# EasyEDA Pro project ProProject_ssd1306_2024-04-10.epro

# Schematic Schematic1
Create Date: 2023-05-25; Page Name: P1; Project Name: ssd1306; Schematic Name: Schematic1; Update Date: 2023-05-25; Company: 嘉立创EDA; Page Size: A4; Version: V1.0
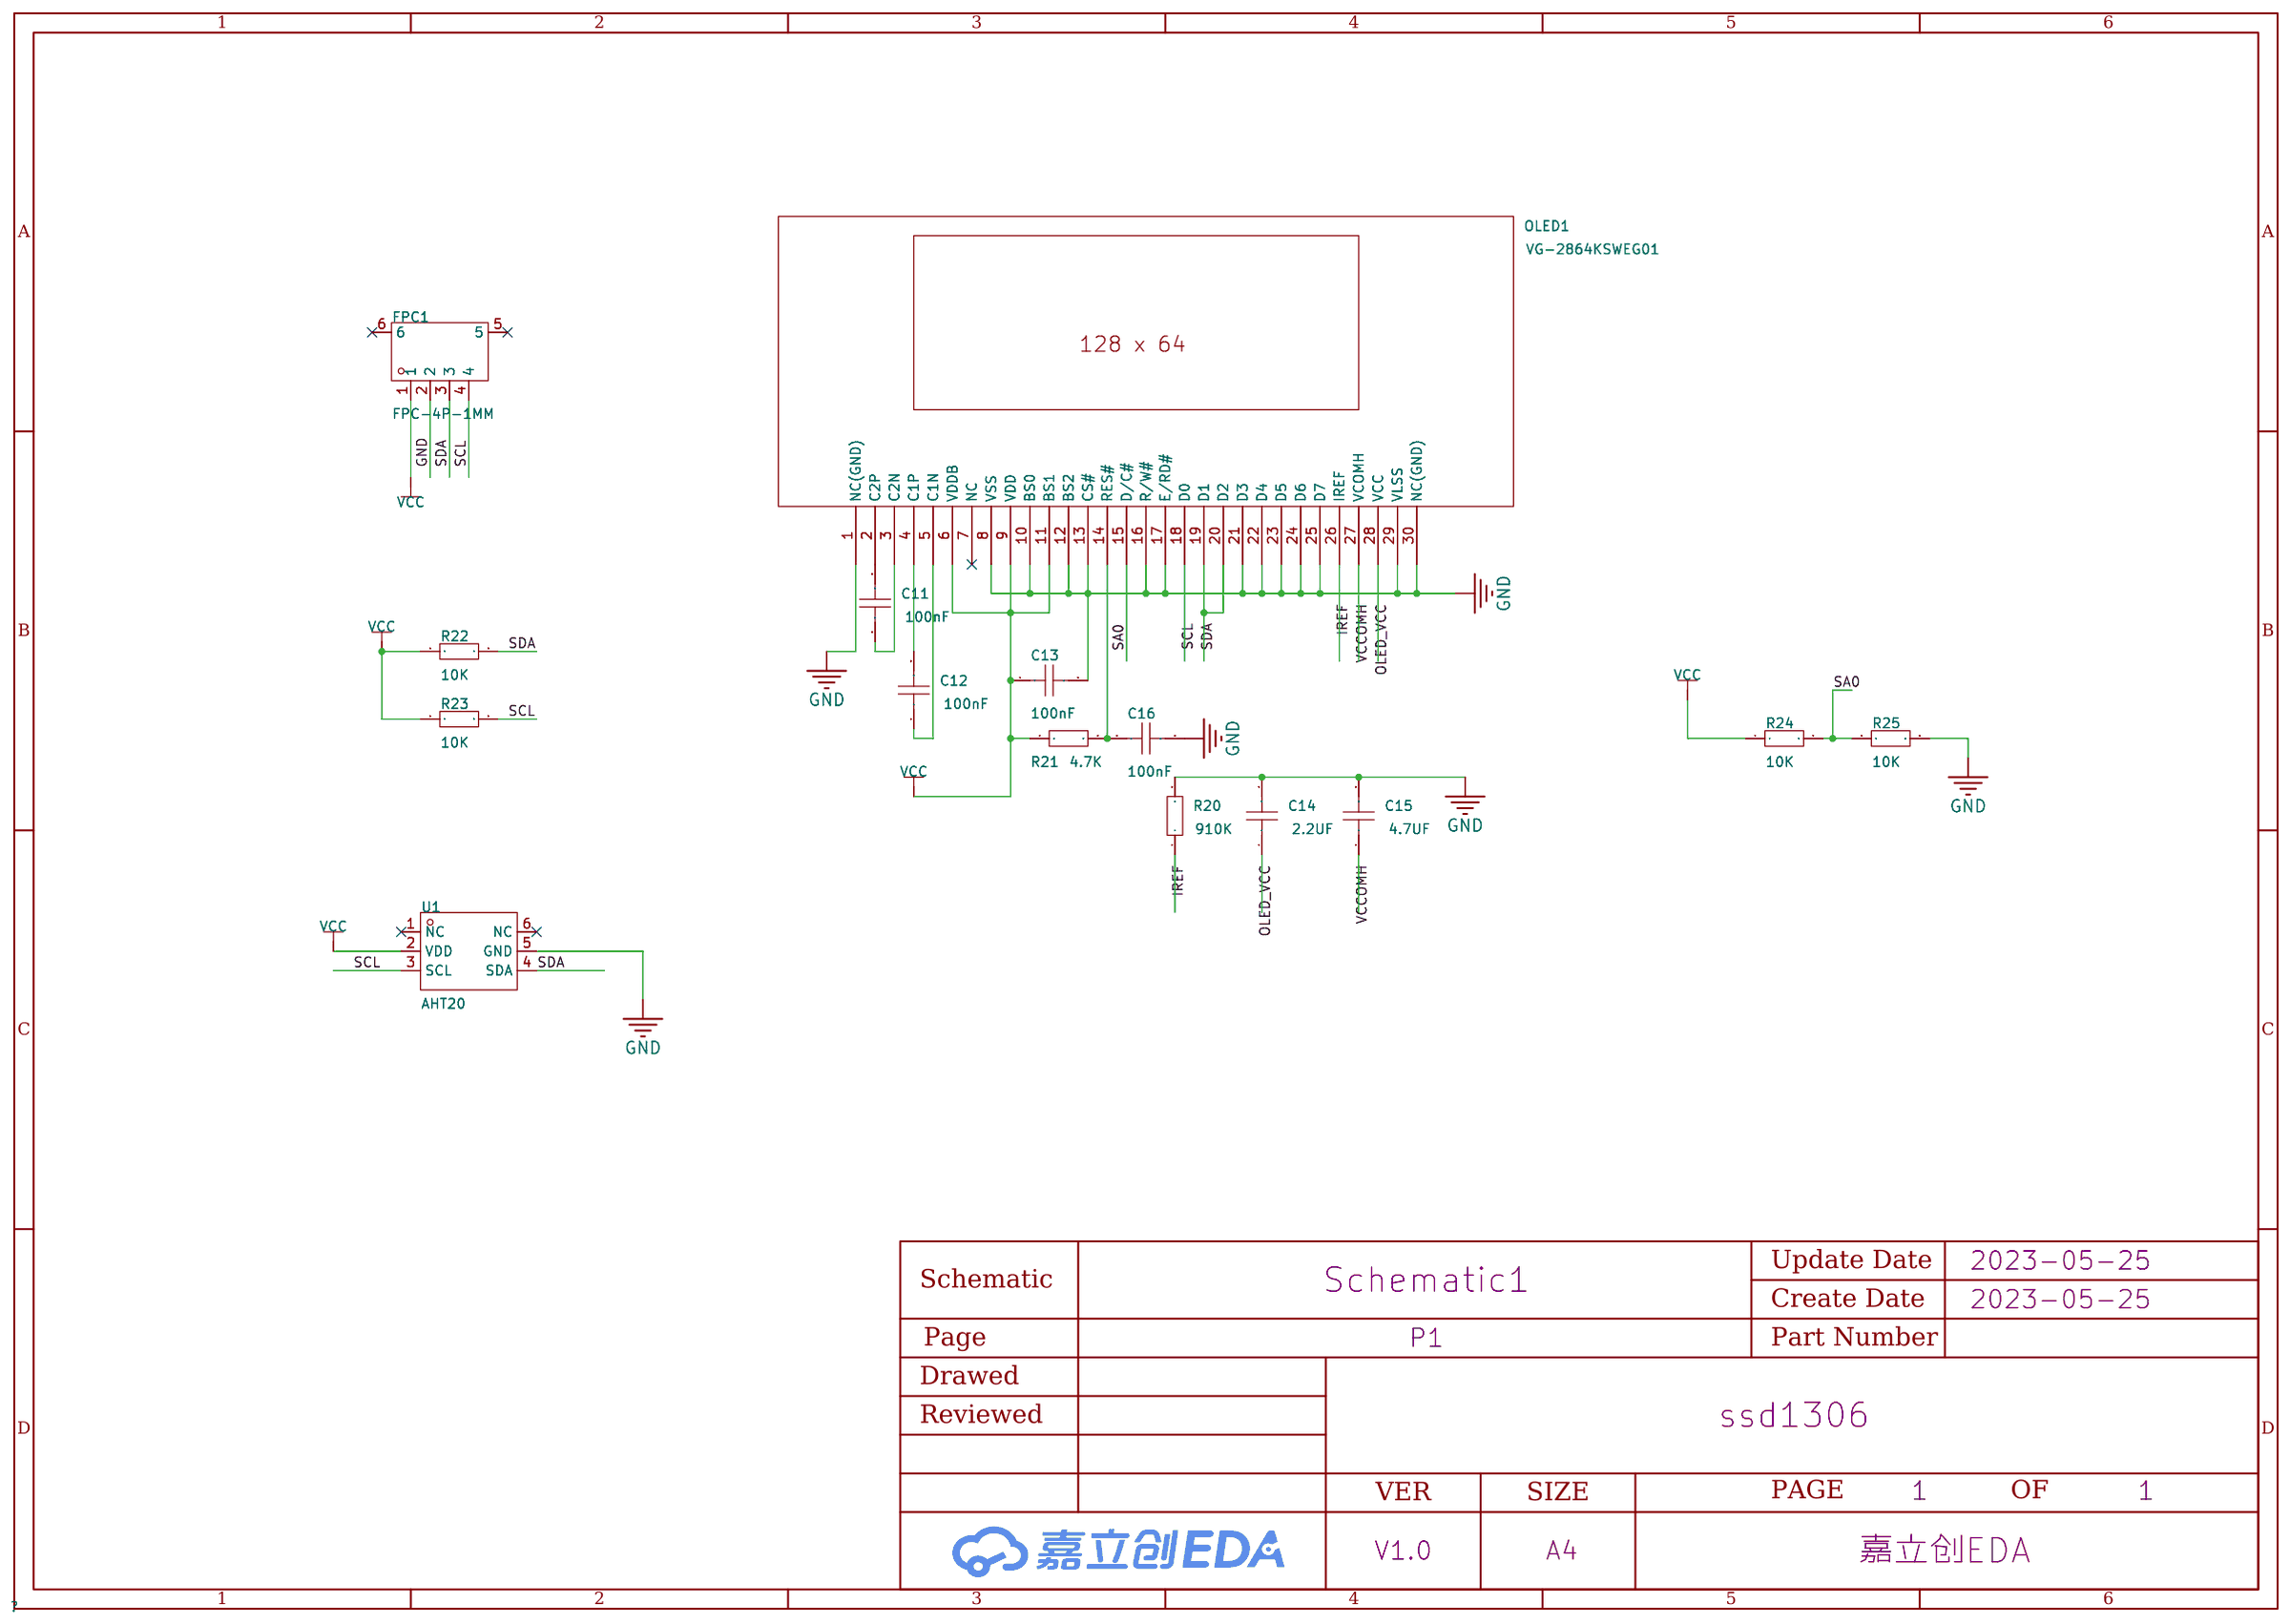
[diagram p0: schematic sheet]

## Parts
C11  100nF  [C0603]
C12  100nF  [C0603]
C13  100nF  [C0603]
C14  2.2UF  [C0603]
C15  4.7UF  [C0603]
C16  100nF  [C0603]
FPC1  FPC-4P-1MM  [FFC-SMD_FFC10032-04SBB123W5M]
OLED1  VG-2864KSWEG01  [OLED_0.96-30P-P0.70-12864]
R20  910K  [R0603]
R21  4.7K  [R0603]
R22  10K  [R0603]
R23  10K  [R0603]
R24  10K  [R0603]
R25  10K  [R0603]
U1  AHT20  [SENSOR-SMD_L3.0-W3.0-P1.00-BR]

## Library data of the parts
C11-C16 = CAP_0603: Supplier Footprint: 0603
FPC1 = FFC10032-04SBB123W5M: 间距:1mm;触点数量:4;锁定特性:翻盖式;安装类型:卧贴;触点类型:下接;工作温度范围:-25℃~+85℃;; LCSC Part Name: 4P 1.0mm; Supplier Part: C2833960; Manufacturer: TXGA(特思嘉); Supplier Footprint: SMD,P=1mm; JLCPCB Part Class: 扩展库; Datasheet: https://atta.szlcsc.com/upload/public/pdf/source/20210517/C2833960_E03CB5ECB54CF7740FC28A24F37CFDA7.pdf; Supplier: LCSC; Pitch: 1mm; Number of Contacts: 4; Locking Feature: 翻盖式; Mounting Type: 卧贴; Contact Type: 下接; Height Above Board: 2.13mm; FFC, FCB Thickness: 0.3mm~0.3mm; Operating Temperature Range: -25℃~+85℃
OLED1 = VG-2864KSWEG01: 尺寸(inch):0.96;主控芯片:SSD1306;; LCSC Part Name: 0.96”128x64白色 VG-2864KSWEG01; Supplier Part: C194313; Manufacturer: WiseChip(智晶光电); JLCPCB Part Class: 扩展库; Datasheet: https://atta.szlcsc.com/upload/public/pdf/source/20190118/C194313_EB7CEF44C1C1CB8B071218A368D72B17.pdf; Supplier: LCSC; Size: 0.96; Main Control Chip: SSD1306
R20-R25 = Res_0603: Supplier Footprint: 0603
U1 = AHT20: Supplier Part: C2757850; Manufacturer: 广州奥松; Supplier Footprint: SMD; JLCPCB Part Class: 扩展库; Datasheet: https://atta.szlcsc.com/upload/public/pdf/source/20231023/00557B34ED120268320A4810FF8DED4D.pdf; Supplier: LCSC

## Nets
GND: C13.2 C14.2 C15.2 C16.2 FPC1.2 OLED1.1(NC(GND)) OLED1.8(VSS) OLED1.10(BS0) OLED1.12(BS2) OLED1.13(CS#) OLED1.16(R/W#) OLED1.17(E/RD#) OLED1.21(D3) OLED1.22(D4) OLED1.23(D5) OLED1.24(D6) OLED1.25(D7) OLED1.29(VLSS) OLED1.30(NC(GND)) R20.2 R25.2 U1.5(GND)
VCC: C13.1 FPC1.1 OLED1.6(VDDB) OLED1.9(VDD) OLED1.11(BS1) R21.1 R22.1 R23.1 R24.1 U1.2(VDD)
VCCOMH: C15.1 OLED1.27(VCOMH)
IREF: OLED1.26(IREF) R20.1
OLED_VCC: C14.1 OLED1.28(VCC)
SA0: OLED1.15(D/C#) R24.2 R25.1
SCL: FPC1.4 OLED1.18(D0) R23.2 U1.3(SCL)
SDA: FPC1.3 OLED1.19(D1) OLED1.20(D2) R22.2 U1.4(SDA)
$1N424: C11.2 OLED1.2(C2P)
$1N425: C12.2 OLED1.4(C1P)
$1N426: C11.1 OLED1.3(C2N)
$1N427: C12.1 OLED1.5(C1N)
$1N447: C16.1 OLED1.14(RES#) R21.2

Not connected (* = marked no-connect by the designer): FPC1 5* 6*; OLED1 7(NC)*; U1 1(NC)* 6(NC)*

# Board PCB1
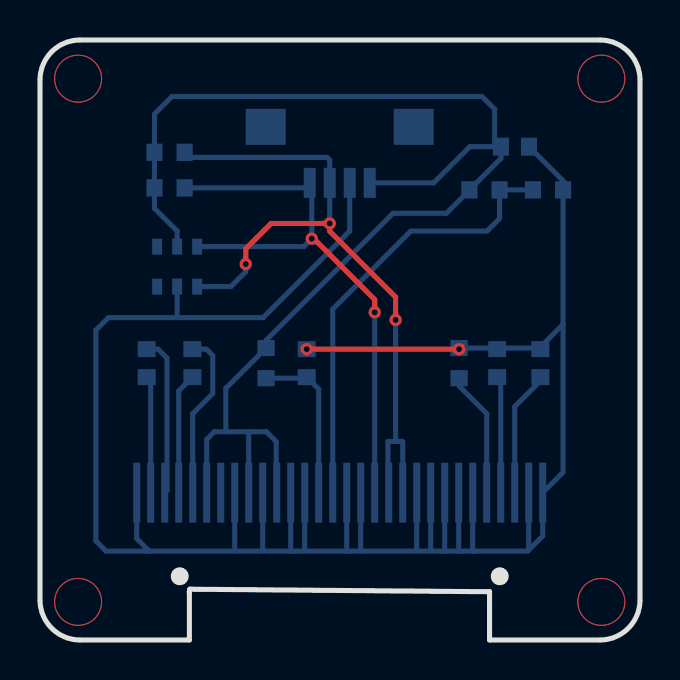
[diagram p1: board, top side]
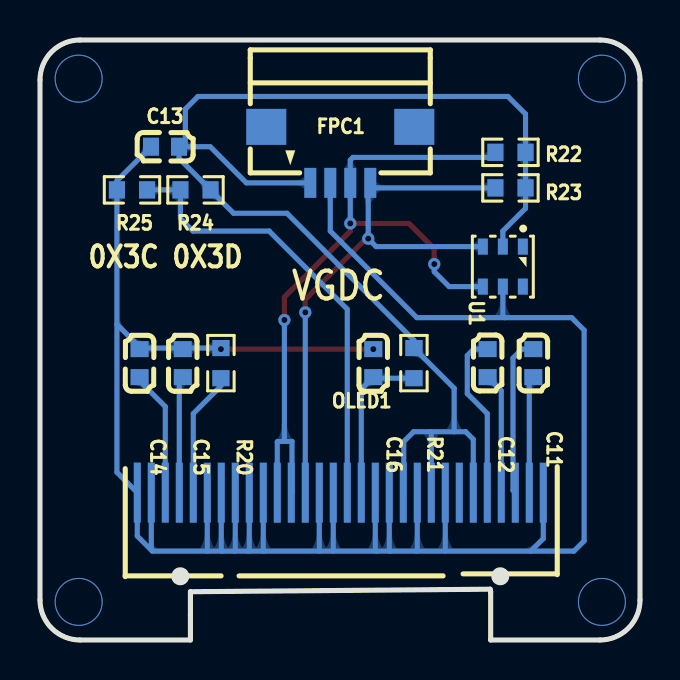
[diagram p2: board, bottom side, seen from below]

Outline 30 x 30 mm; copper layers: Top Layer, Bottom Layer. Coordinates in mm from the lower left corner of the outline.
Outline path: 0,28 0,2 arc(0.59,0.59) 2,0 7.47,0 7.47,2.41 7.49,2.54 22.48,2.41 22.48,0 28,0 arc(29.41,0.59) 30,2 30,28 arc(29.41,29.41) 28,30 2,30 arc(0.59,29.41) 0,28
Stack: Top Layer 0.035mm / Dielectric1 1.51mm FR4 er 4.5 / Bottom Layer 0.035mm

## Design rules (mm)
template: JLCPCB Capability(Two Layers Board)
spacing copperThickness1oz (default): track to track 0.102, other pairs 0.152 to 0.3
spacing copperThickness2oz: track to track 0.203, other pairs 0.152 to 0.3
track width copperThickness1oz (default): min 0.127, default 0.254, max 2.54
track width copperThickness2oz: min 0.203, default 0.254, max 2.54
differential pair differentialPair (default): width min 0.127, default 0.254, max 2.54; gap min 0.152, default 0.152
via viaSize (default): diameter min 0.5, default 0.61, max 10; hole min 0.3, default 0.305, max 6.3

## Placement (name value [footprint] x y rotation side)
C11  100nF  [C0603]  5.33 13.84 270 bottom
C12  100nF  [C0603]  7.62 13.84 270 bottom
C13  100nF  [C0603]  23.75 24.67 0 bottom
C14  2.2UF  [C0603]  25.02 13.84 90 bottom
C15  4.7UF  [C0603]  22.86 13.84 90 bottom
C16  100nF  [C0603]  13.33 13.84 90 bottom
FPC1  FPC-4P-1MM  [ffc-smd_ffc10032-04sbb123w5m]  14.99 24.26 0 bottom
OLED1  VG-2864KSWEG01  [OLED_0.96-30P-P0.70-12864]  14.99 7.37 0 bottom
R20  910K  [R0603]  20.95 13.84 90 bottom
R21  4.7K  [R0603]  11.3 13.84 270 bottom
R22  10K  [R0603]  6.48 24.38 0 bottom
R23  10K  [R0603]  6.48 22.61 0 bottom
R24  10K  [R0603]  22.22 22.51 0 bottom
R25  10K  [R0603]  25.4 22.51 0 bottom
U1  AHT20  [SENSOR-SMD_L3.0-W3.0-P1.00-BR]  6.86 18.67 90 bottom

## Footprints (pads in the part's own frame, mm; a bottom-side part is the same pattern mirrored in y, then rotated)
C0603
  rect 0.8x0.9 smd: 1(-0.7,0) 2(0.7,0)
ffc-smd_ffc10032-04sbb123w5m
  rect 0.6x1.5 smd: 1(1.5,1.4) 2(0.5,1.4) 3(-0.5,1.4) 4(-1.5,1.4)
  rect 2x1.8 smd: 5(-3.7,-1.4) 6(3.7,-1.4)
OLED_0.96-30P-P0.70-12864
  rect 0.35x3 smd: 1(-10.15,0.003) 2(-9.45,0.001) 3(-8.75,0.001) 4(-8.05,0.001) 5(-7.35,0.001) 6(-6.65,0.001) 7(-5.95,0.001) 8(-5.25,0.001) 9(-4.55,0.001) 10(-3.85,0.001) 11(-3.15,0.001) 12(-2.45,0.001) 13(-1.75,0.001) 14(-1.05,0.001) 15(-0.35,0.001) 16(0.35,0.001) 17(1.05,0.001) 18(1.75,0.001) 19(2.45,0.001) 20(3.15,0.001) 21(3.85,0.001) 22(4.55,0.001) 23(5.25,0.001) 24(5.95,0.001) 25(6.65,0.001) 26(7.35,0.001) 27(8.05,0.001) 28(8.75,-0.002) 29(9.45,-0.003) 30(10.15,-0.003)
R0603
  rect 0.806x0.864 smd: 1(-0.753,0) 2(0.753,0)
SENSOR-SMD_L3.0-W3.0-P1.00-BR
  rect 0.8x0.5 smd: 1(1,-1) 2(1,0) 3(1,1) 4(-1,1) 5(-1,0) 6(-1,-1)

## Nets
As in the schematic.

Pads without a net: FPC1 5 6; OLED1 7; U1 1 6

## Via types
v1: diameter 2.4, hole 2.3, Top Layer to Bottom Layer, 4 vias
v2: diameter 0.61, hole 0.305, Top Layer to Bottom Layer, 7 vias

## Routing (per net, layer and track width the routed paths; a pad name or vN(x,y) marks a point on that pad's centre or on a via; arc(x,y) is an arc through that point)
GND: length 124.5
  Top Layer w0.254: v2(13.33,14.54) v2(20.95,14.54)
  Bottom Layer w0.254: 21.63,4.45 21.64,4.45 OLED1.25 ; 21.63,4.45 24.38,4.45 24.44,4.5 ; 21.63,4.45 20.89,4.45 ; 19.59,4.45 19.54,4.5 OLED1.22 ; 19.59,4.45 20.28,4.45 ; 19.59,4.45 18.8,4.45 ; 11.18,4.45 11.14,4.49 OLED1.10 ; 11.18,4.45 12.52,4.45 ; 11.18,4.45 5.46,4.45 ; 5.46,4.45 3.3,4.45 2.79,4.95 2.79,15.49 3.42,16.12 6.77,16.12 ; 5.46,4.45 4.84,5.07 OLED1.1 ; 20.28,4.45 20.24,4.49 OLED1.23 ; 20.28,4.45 20.89,4.45 ; 15.36,4.45 15.34,4.47 OLED1.16 ; 15.36,4.45 13.17,4.45 ; 15.36,4.45 16.02,4.45 ; OLED1.8 9.74,4.45 ; 24.44,4.5 OLED1.29 ; 24.44,4.5 25.14,5.2 OLED1.30 26.15,8.39 26.15,15.78 ; 12.52,4.45 13.17,4.45 ; 12.52,4.45 12.54,4.47 OLED1.12 ; 13.17,4.45 13.24,4.52 OLED1.13 ; 26.15,15.78 R25.2 26.15,22.96 C13.2 ; 26.15,15.78 24.97,14.6 ; 16.02,4.45 16.04,4.46 OLED1.17 ; 16.02,4.45 18.8,4.45 ; 6.77,16.12 11.16,16.12 15.49,20.45 FPC1.2 ; 6.77,16.12 6.86,16.21 U1.5 ; OLED1.24 20.94,4.49 20.89,4.45 ; 24.97,14.6 C14.2 ; 24.97,14.6 R20.2 v2(20.95,14.54) ; 18.8,4.45 18.84,4.48 OLED1.21
VCC: length 67.6
  Bottom Layer w0.254: 10.47,10.41 10.44,10.38 OLED1.9 ; 10.47,10.41 9.29,10.41 ; 10.47,10.41 11.32,10.41 11.81,9.92 11.81,7.39 OLED1.11 ; 9.29,10.41 9.29,12.58 R21.1 11.3,14.99 17.65,21.34 20.32,21.34 21.47,22.49 R24.1 23.05,24.08 C13.1 22.82,24.67 ; 9.29,10.41 8.72,10.41 8.34,10.03 OLED1.6 ; 22.82,24.67 21.49,24.67 19.68,22.86 FPC1.1 ; 22.82,24.67 22.73,24.75 22.73,26.54 22.1,27.18 6.6,27.18 5.72,26.3 R22.1 R23.1 5.72,21.58 6.86,20.45 U1.2
VCCOMH: length 5.9
  Bottom Layer w0.254: C15.1 23.04,12.97 OLED1.27
(no net):
  vias: v1(1.91,28.07) v1(1.91,1.91) v1(28.07,28.07) v1(28.07,1.91)
IREF: length 6.3
  Bottom Layer w0.254: R20.1 20.95,12.7 22.34,11.32 OLED1.26
OLED_VCC: length 6.3
  Bottom Layer w0.254: OLED1.28 23.74,11.67 25.02,12.95 C14.1
SA0: length 22.5
  Bottom Layer w0.254: R25.1 R24.2 22.98,21.07 22.35,20.45 18.54,20.45 14.64,16.54 OLED1.15
SCL: length 29.2
  Top Layer w0.254: v2(16.74,16.38) 16.74,17.02 13.69,20.07 v2(13.59,20.07)
  Bottom Layer w0.254: OLED1.18 v2(16.74,16.38) ; R23.2 13.23,22.61 FPC1.4 13.59,22.75 v2(13.59,20.07) 13.19,19.67 U1.3
SDA: length 37.3
  Top Layer w0.254: v2(10.29,18.8) 10.29,19.56 11.56,20.83 v2(14.49,20.83) 14.49,20.44 17.78,17.15 v2(17.78,16)
  Bottom Layer w0.254: R22.2 7.48,24.13 14.35,24.13 14.49,24 FPC1.3 v2(14.49,20.83) ; U1.4 9.54,17.67 10.29,18.42 v2(10.29,18.8) ; OLED1.20 18.14,9.91 18.11,9.93 17.4,9.93 17.4,7.4 OLED1.19 ; v2(17.78,16) 17.78,9.93
$1N424: length 5.9
  Bottom Layer w0.254: C11.2 5.54,12.94 OLED1.2
$1N425: length 6.1
  Bottom Layer w0.254: OLED1.4 6.94,12.46 C12.2
$1N426: length 8
  Bottom Layer w0.254: C11.1 5.9,14.54 6.35,14.1 6.35,7.48 OLED1.3
$1N427: length 8.4
  Bottom Layer w0.254: C12.1 8.32,14.54 8.64,14.22 8.64,12.32 7.64,11.32 OLED1.5
$1N447: length 8.1
  Bottom Layer w0.254: OLED1.14 13.94,12.54 C16.1 13.28,13.09 R21.2

## Copper pours and planes (outline as drawn; the poured copper is in the pictures)
GND on Top Layer: -11.94,37.72 39.12,37.72 39.12,-7.24 -11.94,-7.24
GND on Bottom Layer: -19.05,45.72 50.93,45.72 50.93,-17.91 -19.05,-17.91

Small or netless copper shapes (teardrops, artwork), in the pictures only: 8 on Top Layer, 65 on Bottom Layer

## Text on the board
Bottom Silkscreen Layer: 0X3C | 0X3D | VGDC
